# EAGLE design HDMI-Display_v10dev (EAGLE 6.6.0)

## Sheet 1 of 2
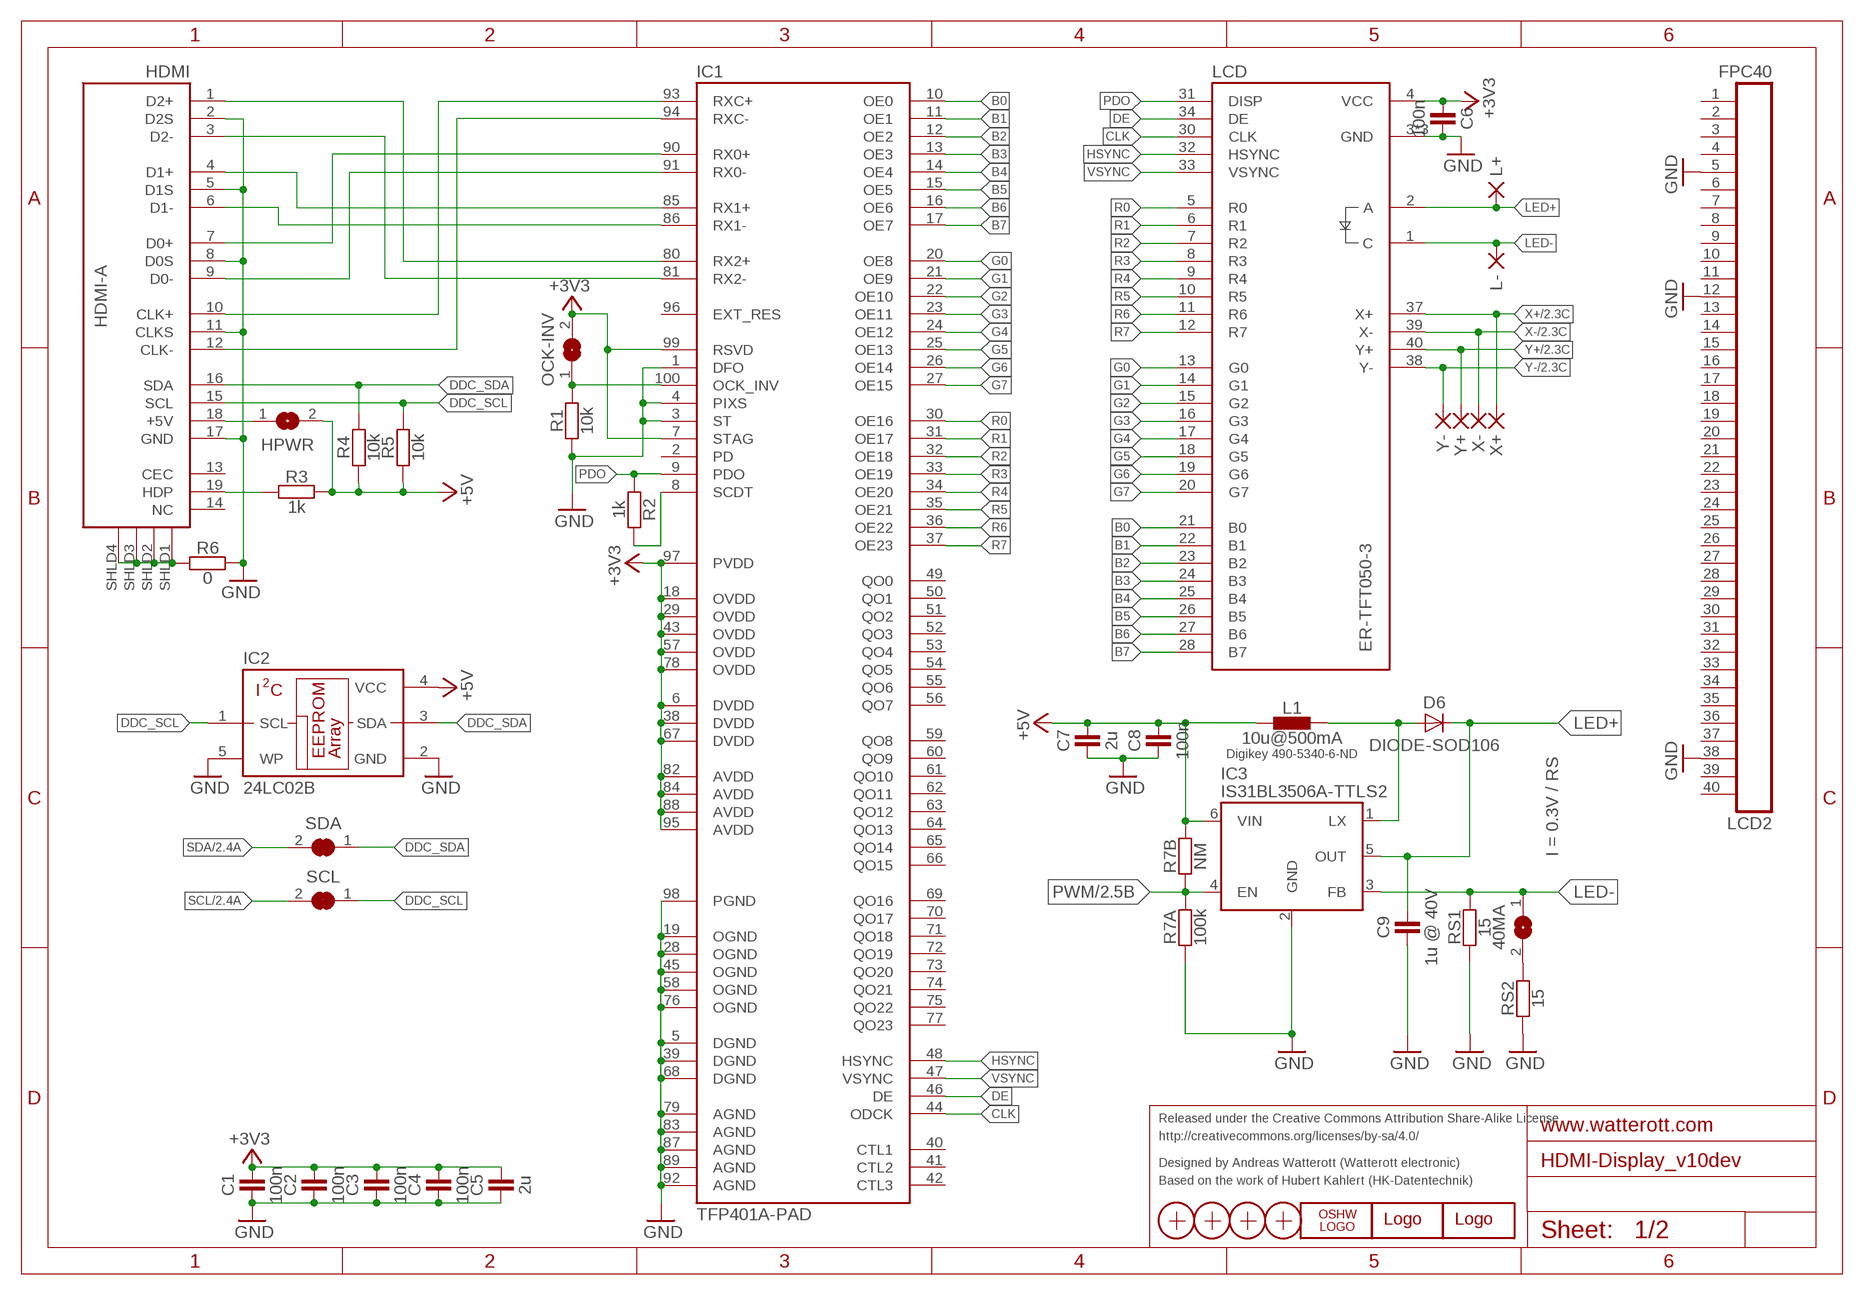
[diagram p0: schematic, sheet 1]

### Parts
40MA  JUMPER2  [JUMPER2]
C1  100n  CAPACITOR-C0402  [R0402]
C2  100n  CAPACITOR-C0402  [R0402]
C3  100n  CAPACITOR-C0402  [R0402]
C4  100n  CAPACITOR-C0402  [R0402]
C5  2u  CAPACITOR-C0402  [R0402]
C6  100n  CAPACITOR-C0402  [R0402]
C7  2u  CAPACITOR-C0402  [R0402]
C8  100n  CAPACITOR-C0402  [R0402]
C9  1u @ 40V  CAPACITOR-C0805  [R0805]
D6  DIODE-SOD106  [SOD106]
HDMI  HDMI-A  [HDMI_10029449]
HPWR  JUMPER2  [JUMPER2]
IC1  TFP401A-PAD  TFP101A-PAD  [TQFP100-PAD]
IC2  24LC02B  24LC-I/OT  [SOT23-5]
IC3  IS31BL3506A-TTLS2  [SOT23-6]
L1  10u@500mA  INDUCTOR-1212  [L_1212]
L+  PAD-0.80X1.60_NC  [PAD-0.80X1.60_NC]
L-  PAD-0.80X1.60_NC  [PAD-0.80X1.60_NC]
LCD  ER-TFT050-3  [FPC40]
LCD2  FPC40  [FPC40]
LOGO1  OSHW_LOGOX0070  [OSHW_6X70]
LOGO2  LOGO-PLACE  [LOGO_TPLACE]
LOGO3  LOGO-S_PLACE_S  [SPARK_TPLACE_S]
OCK-INV  JUMPER2  [JUMPER2]
R1  10k  RESISTOR-R0402  [R0402]
R2  1k  RESISTOR-R0402  [R0402]
R3  1k  RESISTOR-R0402  [R0402]
R4  10k  RESISTOR-R0402  [R0402]
R5  10k  RESISTOR-R0402  [R0402]
R6  0  RESISTOR-R0402  [R0402]
R7A  100k  RESISTOR-R0402  [R0402]
R7B  NM  RESISTOR-R0402  [R0402]
RS1  15  RESISTOR-R0402  [R0402]
RS2  15  RESISTOR-R0402  [R0402]
SCL  JUMPER2  [JUMPER2]
SDA  JUMPER2  [JUMPER2]
X1  PASSER-07  [PASSER_07MM]
X2  PASSER-07  [PASSER_07MM]
X3  PASSER-07  [PASSER_07MM]
X4  PASSER-07  [PASSER_07MM]
X+  PAD-0.80X1.60_NC  [PAD-0.80X1.60_NC]
X-  PAD-0.80X1.60_NC  [PAD-0.80X1.60_NC]
Y+  PAD-0.80X1.60_NC  [PAD-0.80X1.60_NC]
Y-  PAD-0.80X1.60_NC  [PAD-0.80X1.60_NC]

### Nets
+3V3: C1.2 C2.2 C3.2 C4.2 C5.2 C6.1 IC1.6(DVDD) IC1.7(STAG) IC1.18(OVDD) IC1.29(OVDD) IC1.38(DVDD) IC1.43(OVDD) IC1.57(OVDD) IC1.67(DVDD) IC1.78(OVDD) IC1.82(AVDD) IC1.84(AVDD) IC1.88(AVDD) IC1.95(AVDD) IC1.97(PVDD) IC1.99(RSVD) LCD.4(VCC) OCK-INV.2 ; also sheet 2
+5V: C7.2 C8.2 HPWR.2 IC2.4(VCC) IC3.6(VIN) L1.1 R3.2 R4.1 R5.1 R7B.2 ; also sheet 2
B0: IC1.10(OE0) LCD.21(B0)
B1: IC1.11(OE1) LCD.22(B1)
B2: IC1.12(OE2) LCD.23(B2)
B3: IC1.13(OE3) LCD.24(B3)
B4: IC1.14(OE4) LCD.25(B4)
B5: IC1.15(OE5) LCD.26(B5)
B6: IC1.16(OE6) LCD.27(B6)
B7: IC1.17(OE7) LCD.28(B7)
CLK: IC1.44(ODCK) LCD.30(CLK)
CLK_N: HDMI.12(CLK-) IC1.94(RXC-)
CLK_P: HDMI.10(CLK+) IC1.93(RXC+)
D0_N: HDMI.9(D0-) IC1.91(RX0-)
D0_P: HDMI.7(D0+) IC1.90(RX0+)
D1_N: HDMI.6(D1-) IC1.86(RX1-)
D1_P: HDMI.4(D1+) IC1.85(RX1+)
D2_N: HDMI.3(D2-) IC1.81(RX2-)
D2_P: HDMI.1(D2+) IC1.80(RX2+)
DDC_SCL: HDMI.15(SCL) IC2.1(SCL) R5.2 SCL.1
DDC_SDA: HDMI.16(SDA) IC2.3(SDA) R4.2 SDA.1
DE: IC1.46(DE) LCD.34(DE)
G0: IC1.20(OE8) LCD.13(G0)
G1: IC1.21(OE9) LCD.14(G1)
G2: IC1.22(OE10) LCD.15(G2)
G3: IC1.23(OE11) LCD.16(G3)
G4: IC1.24(OE12) LCD.17(G4)
G5: IC1.25(OE13) LCD.18(G5)
G6: IC1.26(OE14) LCD.19(G6)
G7: IC1.27(OE15) LCD.20(G7)
GND: C1.1 C2.1 C3.1 C4.1 C5.1 C6.2 C7.1 C8.1 C9.1 HDMI.2(D2S) HDMI.5(D1S) HDMI.8(D0S) HDMI.11(CLKS) HDMI.17(GND) IC1.1(DFO) IC1.3(ST) IC1.4(PIXS) IC1.5(DGND) IC1.19(OGND) IC1.28(OGND) IC1.39(DGND) IC1.45(OGND) IC1.58(OGND) IC1.68(DGND) IC1.76(OGND) IC1.79(AGND) IC1.83(AGND) IC1.87(AGND) IC1.89(AGND) IC1.92(AGND) IC1.98(PGND) IC2.2(GND) IC2.5(WP) IC3.2(GND) LCD2.5 LCD2.12 LCD2.38 LCD.3(GND) LCD.29(GND) LCD.36(GND) R1.1 R6.1 R7A.1 RS1.1 RS2.1 ; also sheet 2
HDMI_5V: HDMI.18(+5V) HPWR.1
HDMI_DECT: HDMI.19(HDP) R3.1
HSYNC: IC1.48(HSYNC) LCD.32(HSYNC)
LED+: C9.2 D6.C IC3.5(OUT) L+.1(P) LCD.2(A)
LED-: 40MA.1 IC3.3(FB) L-.1(P) LCD.1(C) RS1.2
LX: D6.A IC3.1(LX) L1.2
N$4: 40MA.2 RS2.2
N$6: IC1.100(OCK_INV) OCK-INV.1 R1.2
PDO: IC1.9(PDO) LCD.31(DISP) R2.1
PWM: IC3.4(EN) R7A.2 R7B.1 ; also sheet 2
R0: IC1.30(OE16) LCD.5(R0)
R1: IC1.31(OE17) LCD.6(R1)
R2: IC1.32(OE18) LCD.7(R2)
R3: IC1.33(OE19) LCD.8(R3)
R4: IC1.34(OE20) LCD.9(R4)
R5: IC1.35(OE21) LCD.10(R5)
R6: IC1.36(OE22) LCD.11(R6)
R7: IC1.37(OE23) LCD.12(R7)
SCDT: IC1.8(SCDT) R2.2
SCL: SCL.2 ; also sheet 2
SDA: SDA.2 ; also sheet 2
SHLD3: HDMI.SHLD1(SHLD) HDMI.SHLD2(SHLD) HDMI.SHLD3(SHLD) HDMI.SHLD4(SHLD) R6.2
VSYNC: IC1.47(VSYNC) LCD.33(VSYNC)
X+: LCD.37(X+) X+.1(P) ; also sheet 2
X-: LCD.39(X-) X-.1(P) ; also sheet 2
Y+: LCD.40(Y+) Y+.1(P) ; also sheet 2
Y-: LCD.38(Y-) Y-.1(P) ; also sheet 2
Unconnected: HDMI.13(CEC) HDMI.14(NC) IC1.2(PD) IC1.40(CTL1) IC1.41(CTL2) IC1.42(CTL3) IC1.49(QO0) IC1.50(QO1) IC1.51(QO2) IC1.52(QO3) IC1.53(QO4) IC1.54(QO5) IC1.55(QO6) IC1.56(QO7) IC1.59(QO8) IC1.60(QO9) IC1.61(QO10) IC1.62(QO11) IC1.63(QO12) IC1.64(QO13) IC1.65(QO14) IC1.66(QO15) IC1.69(QO16) IC1.70(QO17) IC1.71(QO18) IC1.72(QO19) IC1.73(QO20) IC1.74(QO21) IC1.75(QO22) IC1.77(QO23) IC1.96(EXT_RES) LCD2.1 LCD2.2 LCD2.3 LCD2.4 LCD2.6 LCD2.7 LCD2.8 LCD2.9 LCD2.10 LCD2.11 LCD2.13 LCD2.14 LCD2.15 LCD2.16 LCD2.17 LCD2.18 LCD2.19 LCD2.20 LCD2.21 LCD2.22 LCD2.23 LCD2.24 LCD2.25 LCD2.26 LCD2.27 LCD2.28 LCD2.29 LCD2.30 LCD2.31 LCD2.32 LCD2.33 LCD2.34 LCD2.35 LCD2.36 LCD2.37 LCD2.39 LCD2.40

### Notes on the sheet
- Digikey 490-5340-6-ND
- I = 0.3V / RS
- Released under the Creative Commons Attribution Share-Alike License
- http://creativecommons.org/licenses/by-sa/4.0/
- Designed by Andreas Watterott (Watterott electronic)
- Based on the work of Hubert Kahlert (HK-Datentechnik)

## Sheet 2 of 2
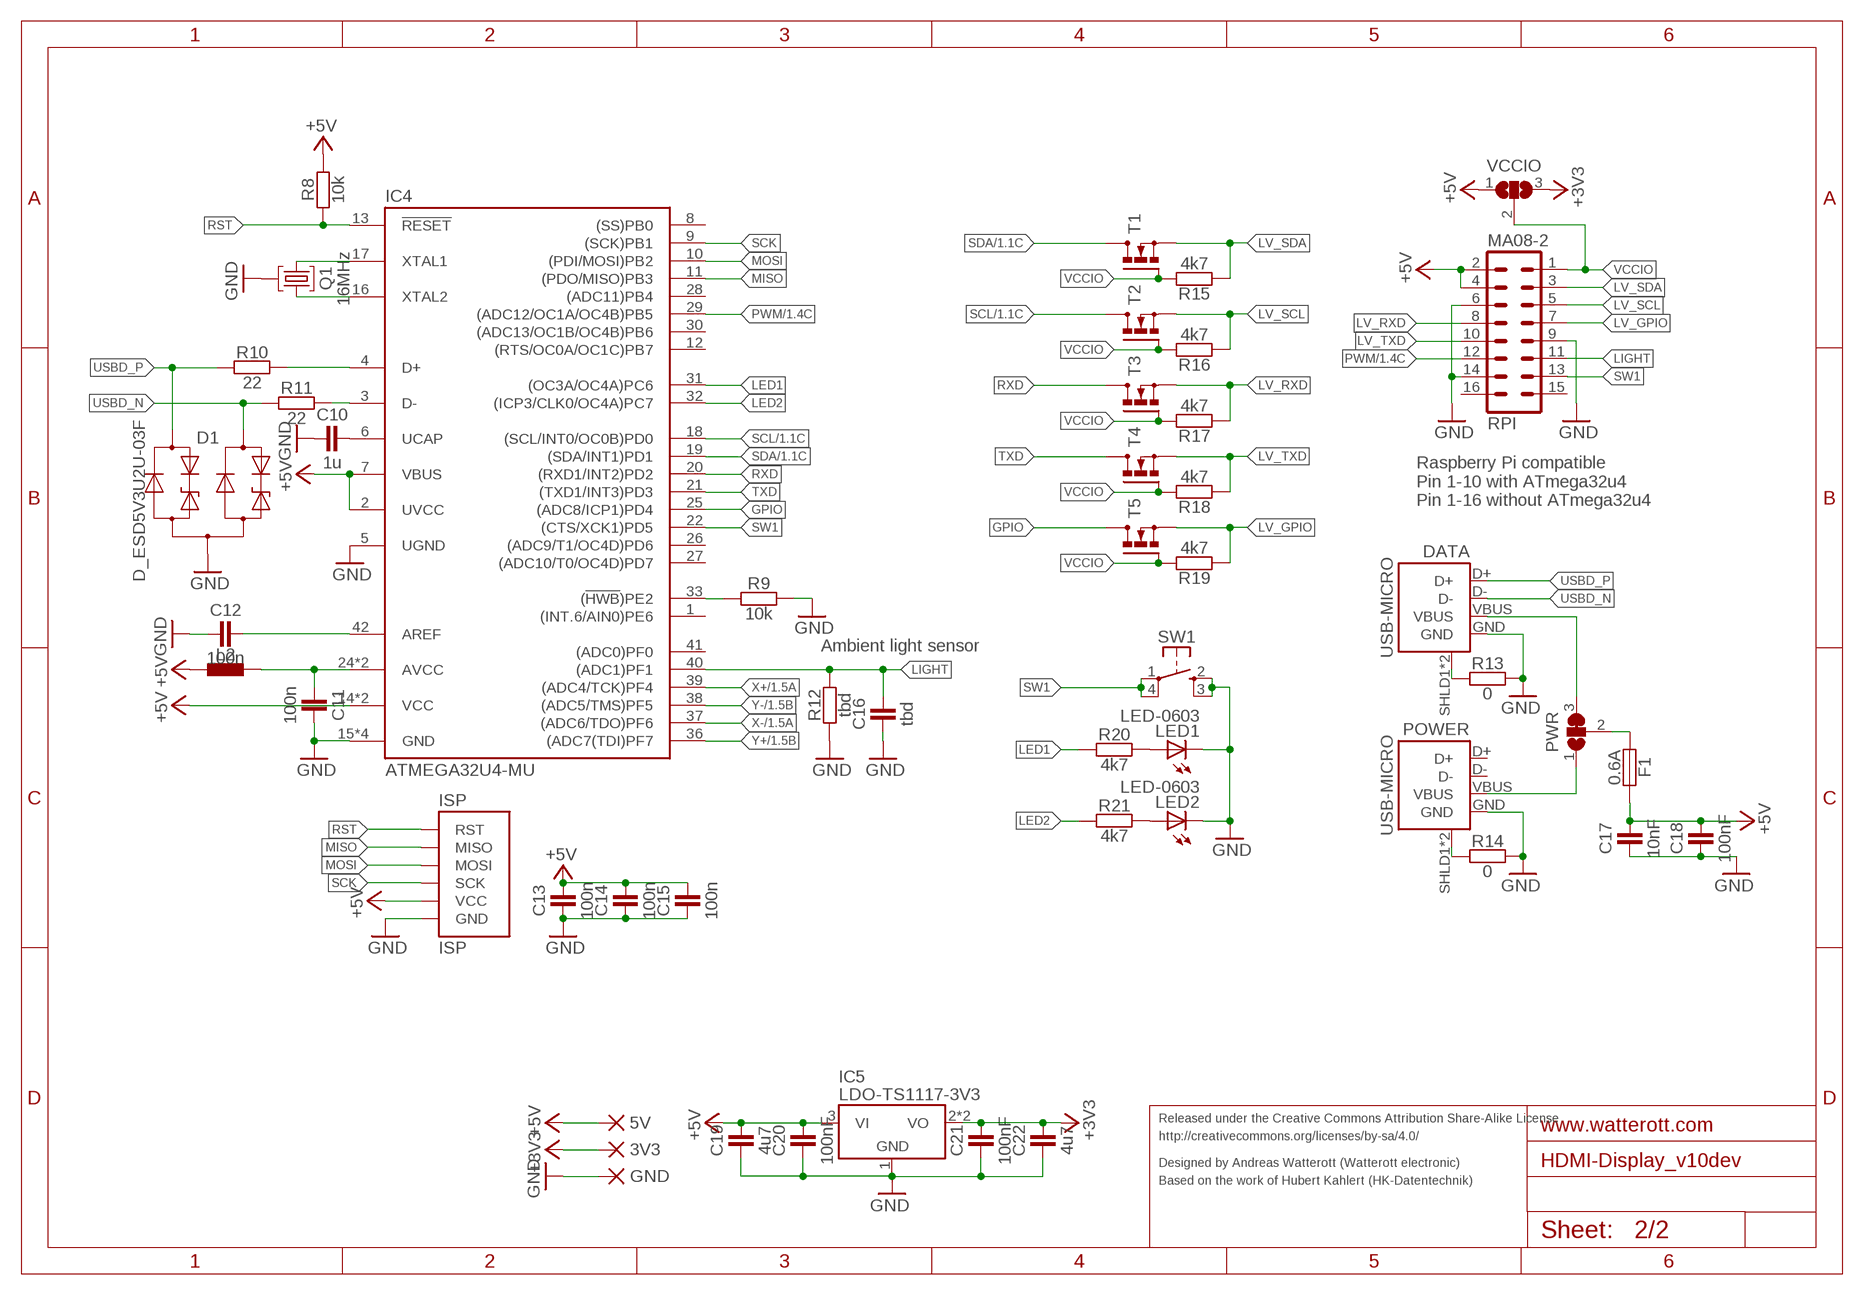
[diagram p1: schematic, sheet 2]

### Parts
3V3  PAD-1.27X2.54_NC  [PAD-1.27X2.54_NC]
5V  PAD-1.27X2.54_NC  [PAD-1.27X2.54_NC]
C10  1u  CAPACITOR-C0402  [R0402]
C11  100n  CAPACITOR-C0402  [R0402]
C12  100n  CAPACITOR-C0402  [R0402]
C13  100n  CAPACITOR-C0402  [R0402]
C14  100n  CAPACITOR-C0402  [R0402]
C15  100n  CAPACITOR-C0402  [R0402]
C16  tbd  CAPACITOR-C0402  [R0402]
C17  10nF  CAPACITOR-C0402  [R0402]
C18  100nF  CAPACITOR-C0402  [R0402]
C19  4u7  CAPACITOR-C0402  [R0402]
C20  100nF  CAPACITOR-C0402  [R0402]
C21  100nF  CAPACITOR-C0402  [R0402]
C22  4u7  CAPACITOR-C0402  [R0402]
D1  D_ESD5V3U2U-03F  [SOT723]
DATA  USB-MICRO  [USB-MICRO-10103594]
F1  0.6A  FUSE-0805  [R0805]
GND  PAD-1.27X2.54_NC  [PAD-1.27X2.54_NC]
IC4  ATMEGA32U4-MU  [QFN44]
IC5  LDO-TS1117-3V3  [SOT223]
ISP  ISP  [ISP]
L2  INDUCTOR-0603  [R0603]
LED1  LED-0603  [LED_0603]
LED2  LED-0603  [LED_0603]
POWER  USB-MICRO  [USB-MICRO-10103594]
PWR  JUMPER3  [JUMPER3]
Q1  16MHz  CRYSTAL-RES-32  [CRYSTAL_32X13]
R8  10k  RESISTOR-R0402  [R0402]
R9  10k  RESISTOR-R0402  [R0402]
R10  22  RESISTOR-R0402  [R0402]
R11  22  RESISTOR-R0402  [R0402]
R12  tbd  RESISTOR-R0402  [R0402]
R13  0  RESISTOR-R0402  [R0402]
R14  0  RESISTOR-R0402  [R0402]
R15  4k7  RESISTOR-R0402  [R0402]
R16  4k7  RESISTOR-R0402  [R0402]
R17  4k7  RESISTOR-R0402  [R0402]
R18  4k7  RESISTOR-R0402  [R0402]
R19  4k7  RESISTOR-R0402  [R0402]
R20  4k7  RESISTOR-R0402  [R0402]
R21  4k7  RESISTOR-R0402  [R0402]
RPI  MA08-2  [MA08-2]
SW1  SW-TACTILE-TL3315  [SW_TL3315N]
T1  MOSFET-N-SOT23  [SOT23]
T2  MOSFET-N-SOT23  [SOT23]
T3  MOSFET-N-SOT23  [SOT23]
T4  MOSFET-N-SOT23  [SOT23]
T5  MOSFET-N-SOT23  [SOT23]
VCCIO  JUMPER3-NOCREAM  [JUMPER3_NC]

### Nets
+3V3: 3V3.1(P) C21.2 C22.2 IC5.2(VO) IC5.4(VO) VCCIO.3 ; also sheet 1
+5V: 5V.1(P) C13.2 C14.2 C15.2 C17.2 C18.2 C19.2 C20.2 F1.1 IC4.2(UVCC) IC4.7(VBUS) IC4.14(VCC) IC4.34(VCC) IC5.3(VI) ISP.VCC L2.1 R8.2 RPI.2 RPI.4 VCCIO.1 ; also sheet 1
AREF: C12.2 IC4.42(AREF)
AVCC: C11.1 IC4.24(AVCC) IC4.44(AVCC) L2.2
D_N: IC4.3(D-) R11.2
D_P: IC4.4(D+) R10.2
GND: C10.1 C11.2 C12.1 C13.1 C14.1 C15.1 C16.1 C17.1 C18.1 C19.1 C20.1 C21.1 C22.1 D1.3(A) DATA.GND GND.1(P) IC4.5(UGND) IC4.15(GND) IC4.23(GND) IC4.35(GND) IC4.43(GND) IC5.1(GND) ISP.GND LED1.C LED2.C POWER.GND Q1.GND R9.2 R12.1 R13.1 R14.1 RPI.6 RPI.9 RPI.14 SW1.2(S1) SW1.3(S2) ; also sheet 1
GPIO: IC4.25((ADC8/ICP1)PD4) T5.3(D)
HWB: IC4.33((!HWB!)PE2) R9.1
LED1: IC4.31((OC3A/OC4A)PC6) R20.1
LED2: IC4.32((ICP3/CLK0/OC4A)PC7) R21.1
LIGHT: C16.2 IC4.40((ADC1)PF1) R12.2 RPI.11
LV_GPIO: R19.1 RPI.7 T5.2(S)
LV_RXD: R17.1 RPI.8 T3.2(S)
LV_SCL: R16.1 RPI.5 T2.2(S)
LV_SDA: R15.1 RPI.3 T1.2(S)
LV_TXD: R18.1 RPI.10 T4.2(S)
MISO: IC4.11((PDO/MISO)PB3) ISP.MISO
MOSI: IC4.10((PDI/MOSI)PB2) ISP.MOSI
N$8: C10.2 IC4.6(UCAP)
N$11: F1.2 PWR.2
N$17: LED1.A R20.2
N$18: LED2.A R21.2
PWM: IC4.29((ADC12/OC1A/OC4B)PB5) RPI.12 ; also sheet 1
RST: IC4.13(!RESET) ISP.RST R8.1
RXD: IC4.20((RXD1/INT2)PD2) T3.3(D)
SCK: IC4.9((SCK)PB1) ISP.SCK
SCL: IC4.18((SCL/INT0/OC0B)PD0) T2.3(D) ; also sheet 1
SDA: IC4.19((SDA/INT1)PD1) T1.3(D) ; also sheet 1
SHLD1: DATA.SHLD1(SHIELD) DATA.SHLD2(SHIELD) R13.2
SHLD2: POWER.SHLD1(SHIELD) POWER.SHLD2(SHIELD) R14.2
SW1: IC4.22((CTS/XCK1)PD5) RPI.13 SW1.1 SW1.4(P2)
TXD: IC4.21((TXD1/INT3)PD3) T4.3(D)
USBD_N: D1.2(C2) DATA.D- R11.1
USBD_P: D1.1(C1) DATA.D+ R10.1
VBUS: DATA.VBUS PWR.3
VBUS_PWR: POWER.VBUS PWR.1
VCCIO: R15.2 R16.2 R17.2 R18.2 R19.2 RPI.1 T1.1(G) T2.1(G) T3.1(G) T4.1(G) T5.1(G) VCCIO.2
X+: IC4.39((ADC4/TCK)PF4) ; also sheet 1
X-: IC4.37((ADC6/TDO)PF6) ; also sheet 1
XTAL1: IC4.17(XTAL1) Q1.2
XTAL2: IC4.16(XTAL2) Q1.1
Y+: IC4.36((ADC7(TDI)PF7) ; also sheet 1
Y-: IC4.38((ADC5/TMS)PF5) ; also sheet 1
Unconnected: IC4.1((INT.6/AIN0)PE6) IC4.8((SS)PB0) IC4.12((RTS/OC0A/OC1C)PB7) IC4.26((ADC9/T1/OC4D)PD6) IC4.27((ADC10/T0/OC4D)PD7) IC4.28((ADC11)PB4) IC4.30((ADC13/OC1B/OC4B)PB6) IC4.41((ADC0)PF0) POWER.D+ POWER.D- RPI.15 RPI.16

### Notes on the sheet
- Raspberry Pi compatible 
  Pin 1-10 with ATmega32u4
  Pin 1-16 without ATmega32u4
- Ambient light sensor
- Released under the Creative Commons Attribution Share-Alike License
- http://creativecommons.org/licenses/by-sa/4.0/
- Designed by Andreas Watterott (Watterott electronic)
- Based on the work of Hubert Kahlert (HK-Datentechnik)

## Library data of the parts
3V3 5V GND L+ L- X+ X- Y+ Y- = we-rcl:PAD: Pads
40MA HPWR OCK-INV SCL SDA = we-rcl:JUMPER2: 2 Pin Jumpers
C1-C22 = we-rcl:CAPACITOR: Capacitors ...4.7uF @ 6.3V -> 0402 ...10uF @ 16V -> 0603 ...22uF @ 25V -> 0805
D1 = we-rcl:D_ESD5V3U2U: TVS Diode - Uni-directional Ultra Low ESD / Transient Protection Diode (0.4pF@1MHz, 5V); DIGIKEY: ESD5V3U2U-03F H6327DKR-ND
D6 = we-rcl:DIODE: Diodes
DATA POWER = we-con:USB: USB Connectors; DIGIKEY: 609-4050-6-ND
F1 = we-rcl:FUSE: Fuses
HDMI = we-con:HDMI: HDMI Connectors; DIGIKEY: 609-4614-2-ND
IC1 = we-chip:TFP101A: TI TFP401A HDMI/DVI Receiver; DIGIKEY: 296-9987-ND
IC2 = we-chip:24LC*: Microchip I2C EEPROM 2 Kbit - 24LC02B - 24LC02BT-I/OTDKR-ND 32 Kbit- 24LC32A - 24LC32AT-I/OTDKR-ND; DIGIKEY: 24LC32AT-I/OTDKR-ND
IC3 = we-power:IS31BL3506A: ISSI IS31BL3506A Boost Converter for LED Backlight Input: 2.7...5V Output: up to 35V 300mV Feedback Voltage; DIGIKEY: 706-1213-6-ND
IC4 = we-chip:ATMEGA32U4: Atmel ATmega16U4/32U4 AVR Microcontroller
IC5 = we-power:LDO: LDOs TS1117 800mA, Vin max 12V TS9011 250mA, Vin max 12V - compatible AP2210 300mA, Vin max 15V TS5204 150mA, Vin max 16V
ISP = we-board:ISP: 2x6pol ISP connector
L1 = we-power:INDUCTOR: Power Inductors
L2 = we-rcl:INDUCTOR: Inductors
LCD = we-opto:ER-TFT: EastRising Displays ER-TFT043-3 - 4.3" 480x272 (LED 15mA @ 25.0V) ER-TFT050-3 - 5.0" 800x480 (LED @ 40mA @ 19.2V) ER-TFT070-4 - 7.0" 800x480 (LED @ 40mA @ 20.4V)
LCD2 = we-con:FPC40: FPC/ZIF Connector
LED1 LED2 = we-opto:LED: LEDs
LOGO1 = we-symbol:OSHW_LOGO: Open-Source-Hardware Logo
LOGO2 LOGO3 = we-symbol:LOGO: Watterott electronic Logo
PWR VCCIO = we-rcl:JUMPER3: 3 Pin Jumpers
Q1 = we-rcl:CRYSTAL-RES: Crystals Resonator
R1-R6 R7A R7B R8-R21 RS1 RS2 = we-rcl:RESISTOR: Resistors all kinds in 0603 and 0402
RPI = we-con:MA08-2: PIN HEADER; OC_FARNELL: unknown; OC_NEWARK: unknown
SW1 = we-switch:SW-TACTILE: Tactile Switches; DIGIKEY: EG4621TR-ND
T1-T5 = we-transistor:MOSFET-N: N-Channel MOSFET (e.g. IRLML2502, BSS138)
X1-X4 = we-symbol:PASSER: Fiducial Markers

## Board
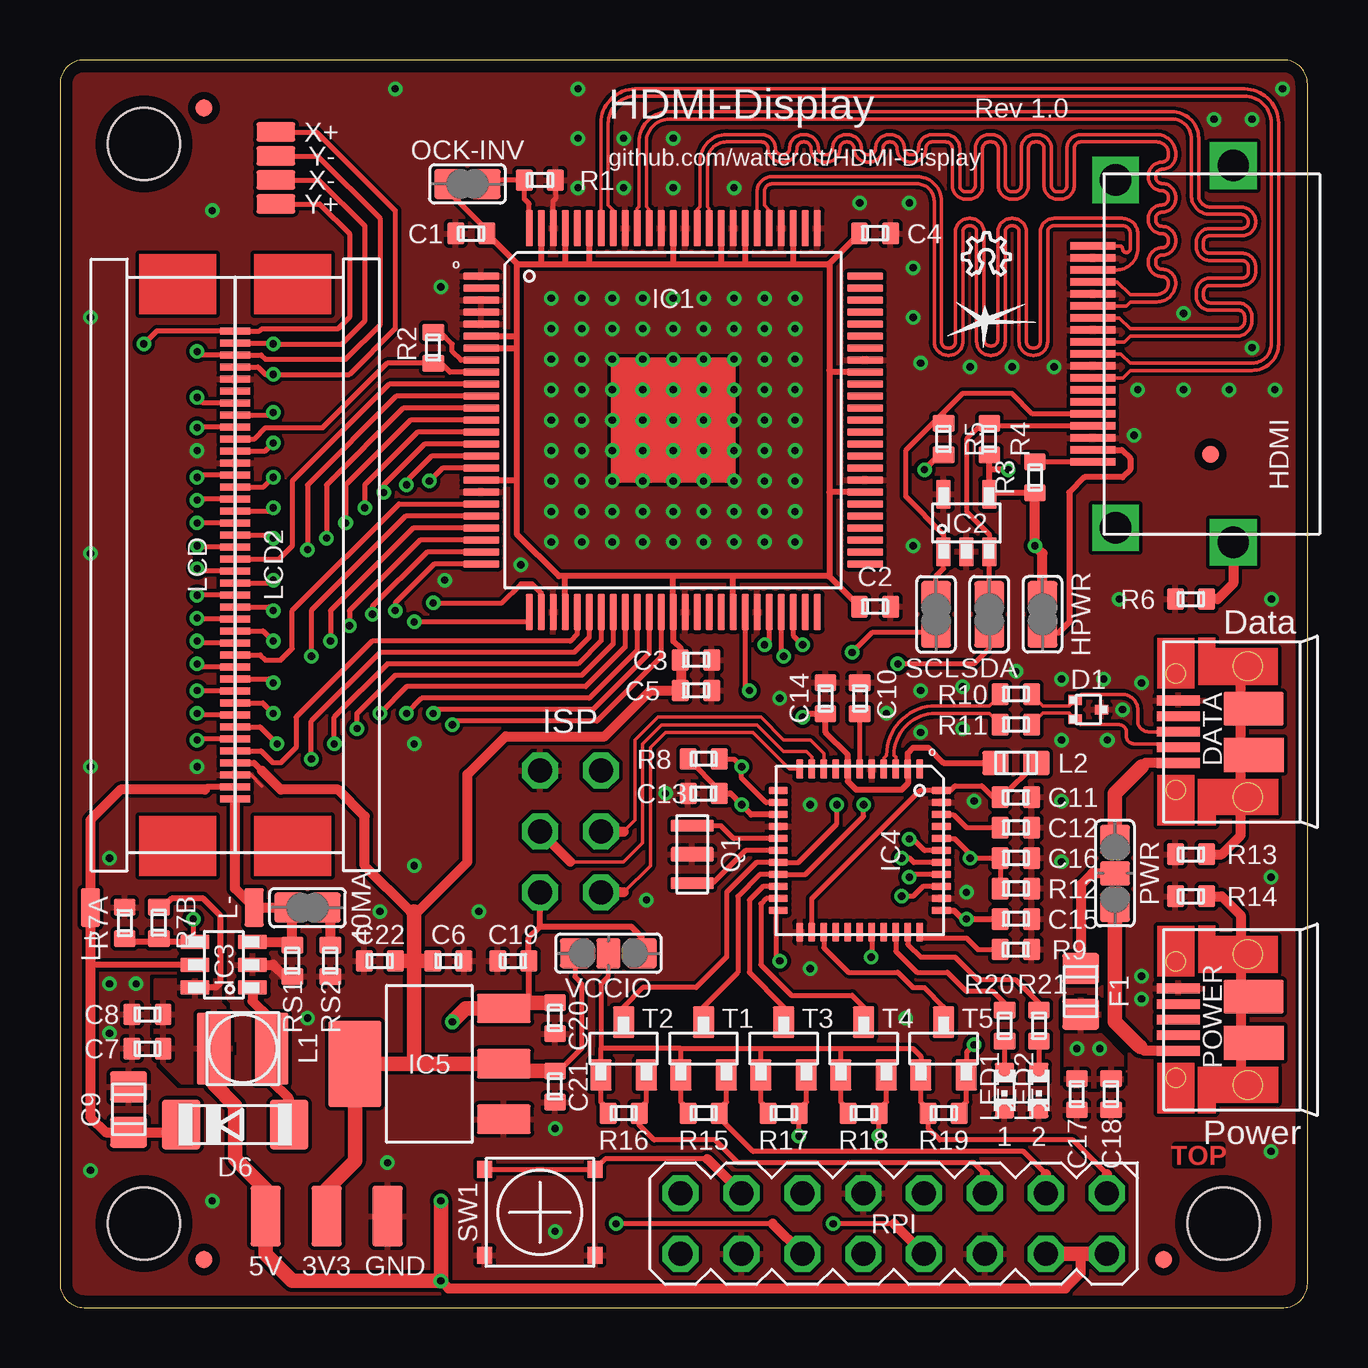
[diagram p2: board, top side]
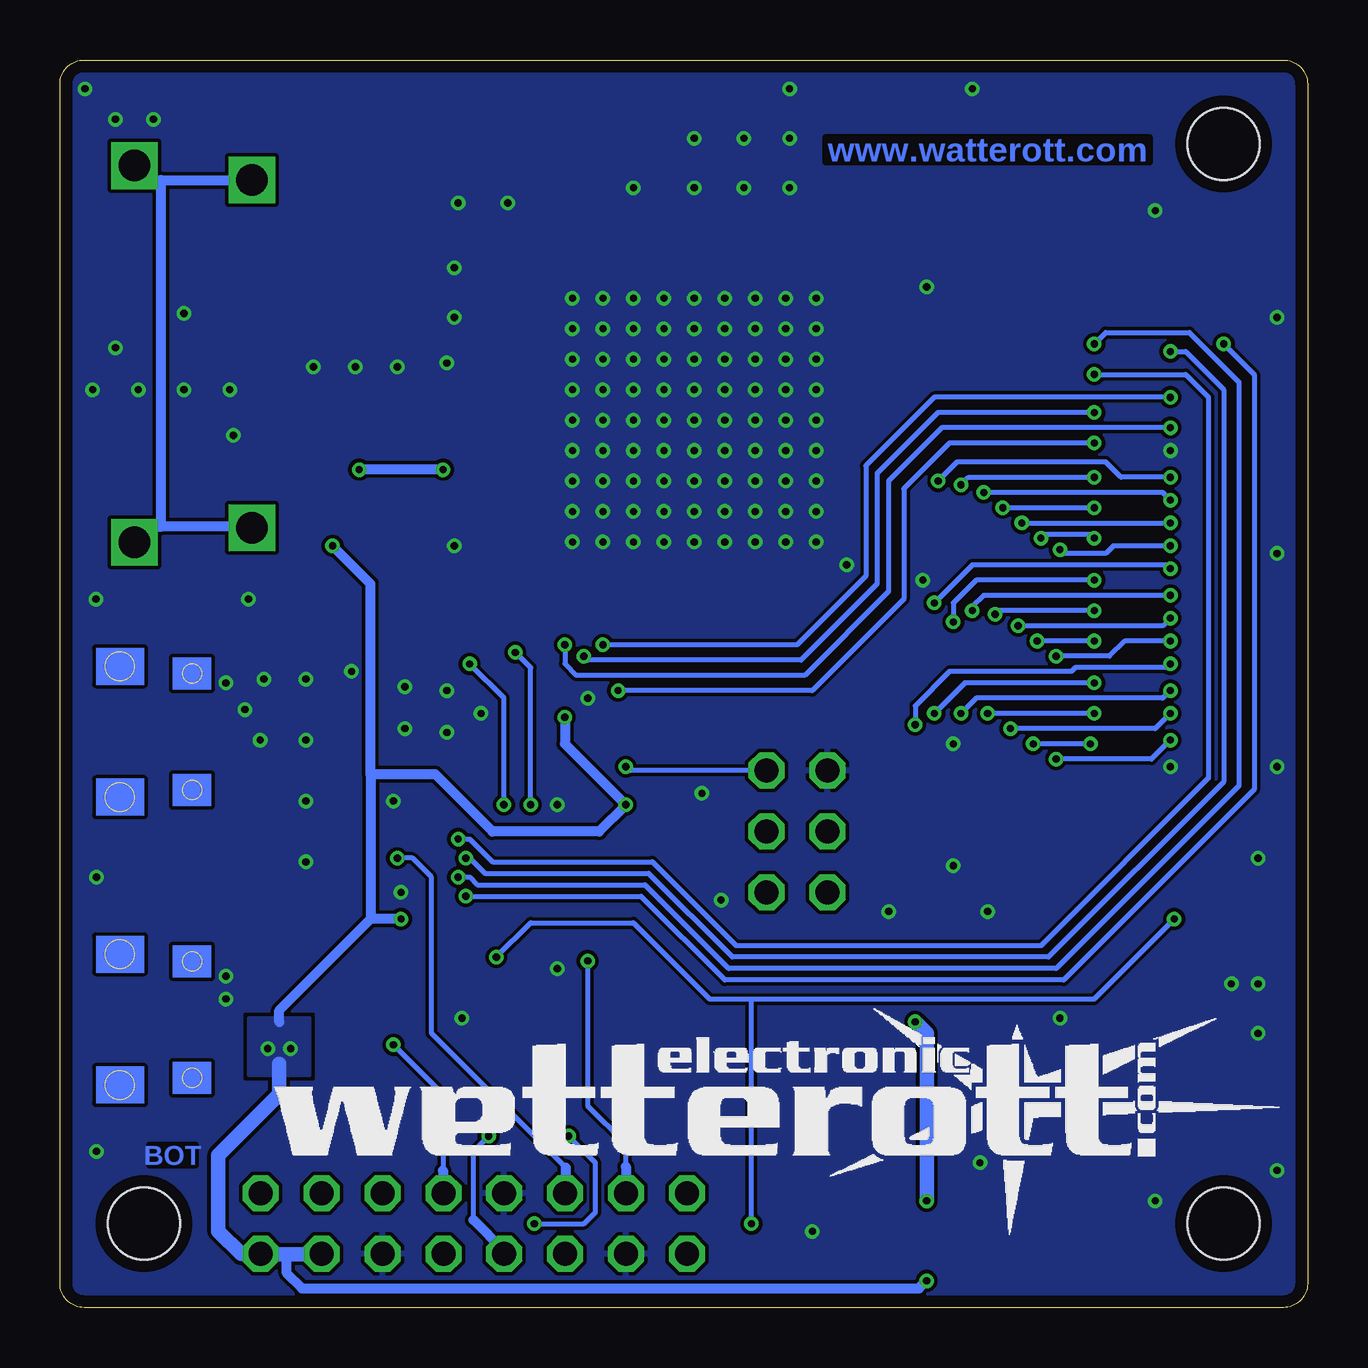
[diagram p3: board, bottom side, seen from below]

Size 52 x 52 mm. Coordinates in mm from the lower left corner, seen from the top.
Outline: 1,0 51,0 arc90 52,1 52,51 arc90 51,52 1,52 arc90 0,51 0,1 arc90 1,0
Copper layers (1*16): Top 0.035mm / dielectric 1.5mm / Bottom 0.035mm
Design rules "default *": minimum track width 6mil, minimum drill 0.3mm, track to track 6mil, track to pad 6mil, pad to pad 6mil, via to via 6mil, smd to smd 6mil, copper to edge 20mil, drill to drill 6mil, minimum pad ring 8mil, minimum via ring 6mil, stop-mask expansion 4mil, vias tented up to drill 0.5mm, thermal gap 6mil
Holes 3 mm at 48.5,3.5 3.5,3.5 3.5,48.5

### Footprints (pad centres in the part's own frame; a part is rotated, then mirrored left to right if it is on the bottom)
PAD-1.27X2.54_NC = smd 1.27 x 2.54: 1 0,0
JUMPER2 = smd 1.25 x 1.25: 1 0,0.76; 2 0,-0.76
R0402 = smd 0.9 x 0.7: 1 0,0.65; 2 0,-0.65
R0805 = smd 1.55 x 1.3: 1 0,0.95; 2 0,-0.95
SOT723 = smd 0.6 x 0.4: 1 -0.55,0.4; 2 -0.55,-0.4; 3 0.55,0
SOD106 = smd 2.1 x 1.6: A 0,-2.25; C 0,2.25
USB-MICRO-10103594 = smd 1.85 x 0.4: D+ -2.885,0; D- -2.885,-0.65; GND -2.885,1.3; ID -2.885,0.65; VBUS -2.885,-1.3 | smd 2.5 x 1.425: SHLD1 0.25,-0.963; SHLD2 0.25,0.963
HDMI_10029449 = smd 1.9 x 0.3: 1 -0.95,4.5; 2 -0.95,4; 3 -0.95,3.5; 4 -0.95,3; 5 -0.95,2.5; 6 -0.95,2; 7 -0.95,1.5; 8 -0.95,1; 9 -0.95,0.5; 10 -0.95,0; 11 -0.95,-0.5; 12 -0.95,-1; 13 -0.95,-1.5; 14 -0.95,-2; 15 -0.95,-2.5; 16 -0.95,-3; 17 -0.95,-3.5; 18 -0.95,-4; 19 -0.95,-4.5 | drill 1.3 square: SHLD1 0,-7.25; SHLD2 4.9,-7.85; SHLD3 4.9,7.85; SHLD4 0,7.25
TQFP100-PAD = smd 1.5 x 0.3: 1 -8,6; 2 -8,5.5; 3 -8,5; 4 -8,4.5; 5 -8,4; 6 -8,3.5; 7 -8,3; 8 -8,2.5; 9 -8,2; 10 -8,1.5; 11 -8,1; 12 -8,0.5; 13 -8,0; 14 -8,-0.5; 15 -8,-1; 16 -8,-1.5; 17 -8,-2; 18 -8,-2.5; 19 -8,-3; 20 -8,-3.5; 21 -8,-4; 22 -8,-4.5; 23 -8,-5; 24 -8,-5.5; 25 -8,-6; 51 8,-6; 52 8,-5.5; 53 8,-5; 54 8,-4.5; 55 8,-4; 56 8,-3.5; 57 8,-3; 58 8,-2.5; 59 8,-2; 60 8,-1.5; 61 8,-1; 62 8,-0.5; 63 8,0; 64 8,0.5; 65 8,1; 66 8,1.5; 67 8,2; 68 8,2.5; 69 8,3; 70 8,3.5; 71 8,4; 72 8,4.5; 73 8,5; 74 8,5.5; 75 8,6 | smd 0.3 x 1.5: 26 -6,-8; 27 -5.5,-8; 28 -5,-8; 29 -4.5,-8; 30 -4,-8; 31 -3.5,-8; 32 -3,-8; 33 -2.5,-8; 34 -2,-8; 35 -1.5,-8; 36 -1,-8; 37 -0.5,-8; 38 0,-8; 39 0.5,-8; 40 1,-8; 41 1.5,-8; 42 2,-8; 43 2.5,-8; 44 3,-8; 45 3.5,-8; 46 4,-8; 47 4.5,-8; 48 5,-8; 49 5.5,-8; 50 6,-8; 76 6,8; 77 5.5,8; 78 5,8; 79 4.5,8; 80 4,8; 81 3.5,8; 82 3,8; 83 2.5,8; 84 2,8; 85 1.5,8; 86 1,8; 87 0.5,8; 88 0,8; 89 -0.5,8; 90 -1,8; 91 -1.5,8; 92 -2,8; 93 -2.5,8; 94 -3,8; 95 -3.5,8; 96 -4,8; 97 -4.5,8; 98 -5,8; 99 -5.5,8; 100 -6,8
SOT23-5 = smd 1.2 x 0.6: 1 -1.2,0.95; 2 -1.2,0; 3 -1.2,-0.95; 4 1.2,-0.95; 5 1.2,0.95
SOT23-6 = smd 1.2 x 0.6: 1 -1.2,0.95; 2 -1.2,0; 3 -1.2,-0.95; 4 1.2,-0.95; 5 1.2,0; 6 1.2,0.95
QFN44 = smd 0.8 x 0.3: 1 -3.4,2.5; 2 -3.4,2; 3 -3.4,1.5; 4 -3.4,1; 5 -3.4,0.5; 6 -3.4,0; 7 -3.4,-0.5; 8 -3.4,-1; 9 -3.4,-1.5; 10 -3.4,-2; 11 -3.4,-2.5; 23 3.4,-2.5; 24 3.4,-2; 25 3.4,-1.5; 26 3.4,-1; 27 3.4,-0.5; 28 3.4,0; 29 3.4,0.5; 30 3.4,1; 31 3.4,1.5; 32 3.4,2; 33 3.4,2.5 | smd 0.3 x 0.8: 12 -2.5,-3.4; 13 -2,-3.4; 14 -1.5,-3.4; 15 -1,-3.4; 16 -0.5,-3.4; 17 0,-3.4; 18 0.5,-3.4; 19 1,-3.4; 20 1.5,-3.4; 21 2,-3.4; 22 2.5,-3.4; 34 2.5,3.4; 35 2,3.4; 36 1.5,3.4; 37 1,3.4; 38 0.5,3.4; 39 0,3.4; 40 -0.5,3.4; 41 -1,3.4; 42 -1.5,3.4; 43 -2,3.4; 44 -2.5,3.4
SOT223 = smd 2.235 x 1.219: 1 -3.099,2.311; 2 -3.099,0; 3 -3.099,-2.311 | smd 2.2 x 3.6: 4 3.099,0
ISP = drill 1 octagon: GND 1.27,-2.54; MISO -1.27,2.54; MOSI 1.27,0; RST -1.27,-2.54; SCK -1.27,0; VCC 1.27,2.54
L_1212 = smd 3 x 1.4: 1 0,1.2; 2 0,-1.2
R0603 = smd 1 x 1.1: 1 0,0.85; 2 0,-0.85
PAD-0.80X1.60_NC = smd 0.8 x 1.6: 1 0,0
FPC40 = smd 1.27 x 0.279: 1 0.003,9.75; 2 0.003,9.25; 3 0.003,8.75; 4 0.003,8.25; 5 0.003,7.75; 6 0.003,7.25; 7 0.003,6.75; 8 0.003,6.25; 9 0.003,5.75; 10 0.003,5.25; 11 0.003,4.75; 12 0.003,4.25; 13 0.003,3.75; 14 0.003,3.25; 15 0.003,2.75; 16 0.003,2.25; 17 0.003,1.75; 18 0.003,1.25; 19 0.003,0.75; 20 0.003,0.25; 21 0.003,-0.25; 22 0.003,-0.75; 23 0.003,-1.25; 24 0.003,-1.75; 25 0.003,-2.25; 26 0.003,-2.75; 27 0.003,-3.25; 28 0.003,-3.75; 29 0.003,-4.25; 30 0.003,-4.75; 31 0.003,-5.25; 32 0.003,-5.75; 33 0.003,-6.25; 34 0.003,-6.75; 35 0.003,-7.25; 36 0.003,-7.75; 37 0.003,-8.25; 38 0.003,-8.75; 39 0.003,-9.25; 40 0.003,-9.75
LED_0603 = smd 0.8 x 0.8: A 0,-0.75; C 0,0.75
JUMPER3 = smd 1.25 x 1.25: 1 0,1.4; 3 0,-1.4 | smd 1.25 x 1: 2 0,0
CRYSTAL_32X13 = smd 1.8 x 0.5: 1 0,1.2; 2 0,-1.2 | smd 1.8 x 0.6: GND 0,0
MA08-2 = drill 1 octagon: 1 -1.27,8.89; 2 1.27,8.89; 3 -1.27,6.35; 4 1.27,6.35; 5 -1.27,3.81; 6 1.27,3.81; 7 -1.27,1.27; 8 1.27,1.27; 9 -1.27,-1.27; 10 1.27,-1.27; 11 -1.27,-3.81; 12 1.27,-3.81; 13 -1.27,-6.35; 14 1.27,-6.35; 15 -1.27,-8.89; 16 1.27,-8.89
SW_TL3315N = smd 0.65 x 0.7: 1 -2.3,1.8; 2 -2.3,-1.8; 3 2.3,-1.8; 4 2.3,1.8
SOT23 = smd 1.3 x 0.9: 1 -1.1,0.95; 2 -1.1,-0.95; 3 1.1,0
JUMPER3_NC = smd 1.25 x 1.25: 1 0,1.4; 3 0,-1.4 | smd 1.25 x 1: 2 0,0
PASSER_07MM = smd 0.7 x 0.7: X 0,0

### Placement (x,y rotation side)
3V3  11.11,3.81 180 top
5V  8.57,3.81 180 top
40MA  10.32,16.67 90 top
C1  17.14,44.77 90 top
C2  33.97,29.21 270 top
C3  26.51,26.99 270 top
C4  33.97,44.77 270 top
C5  26.51,25.72 270 top
C6  16.19,14.45 90 top
C7  3.65,10.79 90 top
C8  3.65,12.22 90 top
C9  2.86,8.26 0 top
C10  33.34,25.4 0 top
C11  39.85,21.27 90 top
C12  39.85,20 270 top
C13  26.83,21.43 90 top
C14  31.91,25.4 0 top
C15  39.85,16.19 270 top
C16  39.85,18.73 270 top
C17  42.39,8.89 180 top
C18  43.81,8.89 180 top
C19  18.89,14.45 90 top
C20  20.64,12.06 180 top
C21  20.64,9.21 180 top
C22  13.34,14.45 90 top
D1  42.86,24.92 0 top
D6  7.3,7.62 90 top
DATA  49.5,24 0 top
F1  42.55,13.18 180 top
GND  13.65,3.81 180 top
HDMI  44,39.75 0 top
HPWR  40.96,28.89 180 top
IC1  25.56,36.99 0 top
IC2  37.78,32.7 90 top
IC3  6.83,14.29 180 top
IC4  33.34,19.05 270 top
IC5  15.4,10.16 180 top
ISP  21.27,19.84 180 top
L1  7.62,10.79 90 top
L2  39.85,22.7 90 top
L+  1.27,16.67 0 top
L-  8.1,16.67 0 top
LCD  7.3,30.96 180 top
LCD2  7.3,30.96 0 top
LED1  39.37,9.05 180 top
LED2  40.8,9.05 180 top
LOGO1  37.62,43.02 0 top
LOGO2  43.34,2.7 0 bottom
LOGO3  38.58,41.12 0 top
OCK-INV  16.99,46.83 270 top
POWER  49.5,12 0 top
PWR  43.97,18.1 180 top
Q1  26.35,18.89 0 top
R1  20,46.99 270 top
R2  15.56,40.01 180 top
R3  40.64,34.61 0 top
R4  38.73,36.2 180 top
R5  36.83,36.2 180 top
R6  47.15,29.53 90 top
R7A  2.7,16.03 0 top
R7B  100k  [R0402]  4.13,16.03 180 top
R8  26.83,22.86 270 top
R9  39.85,14.92 90 top
R10  39.85,25.56 270 top
R11  39.85,24.29 270 top
R12  39.85,17.46 270 top
R13  47.15,18.89 90 top
R14  47.15,17.14 90 top
R15  26.83,8.1 270 top
R16  23.5,8.1 270 top
R17  30.16,8.1 270 top
R18  33.5,8.1 270 top
R19  36.83,8.1 270 top
R20  39.37,11.75 0 top
R21  40.8,11.75 0 top
RPI  34.75,3.5 270 top
RS1  9.68,14.45 180 top
RS2  11.27,14.45 180 top
SCL  36.51,28.89 0 top
SDA  38.73,28.89 0 top
SW1  20,3.97 0 top
T1  26.83,10.79 90 top
T2  23.5,10.79 90 top
T3  30.16,10.79 90 top
T4  33.5,10.79 90 top
T5  36.83,10.79 90 top
VCCIO  22.86,14.76 270 top
X1  6,2 90 top
X2  6,50 90 top
X3  47.96,35.56 90 top
X4  46,2 90 top
X+  9,49 90 top
X-  9,47 90 top
Y+  9,46 90 top
Y-  9,48 90 top

### Tracks (layer width: path | path; a pad name or v marks a point on that pad's centre or on a via)
+3V3
  Top 0.203: 20.06,43.55 20,43.5 | 22.06,43.51 22.07,43.5 | 30.56,43.58 30.48,43.5 | 28.56,43.51 28.57,43.5 | 27.56,43.56 27.62,43.5 | 32.13,38.99 32.07,39.05 | 32.08,33.99 32.07,33.97 | 28.06,30.44 28.1,30.48 | 21.06,30.43 21.11,30.48 | 19.04,40.49 19.05,40.48 | 19.03,39.99 19.05,40.01 | 19.01,34.49 19.05,34.45 | 21.06,43.55 21.11,43.5 | OCK-INV.2 16.23,46.48 17.78,44.93 17.78,44.78 C1.2 | VCCIO.3 21.46,13.78 21.75,13.49 21.75,10.79 20.81,9.86 C21.2 | 25.88,27.46 25.88,26.99 C3.2
  Top 0.254: 19.05,43.5 19.05,40.48 19.05,40.01 19.05,34.45 19.05,32.23 20.8,30.48 21.11,30.48 25.56,30.48 | 19.05,43.5 20,43.5 21.11,43.5 22.07,43.5 25.56,43.5 | 25.56,43.5 27.62,43.5 28.57,43.5 30.48,43.5 32.07,43.5 | 32.07,43.5 32.07,39.05 32.07,33.97 32.07,30.48 | 32.07,30.48 28.1,30.48 25.56,30.48 | IC1.99 20.06,43.55 | IC1.95 22.06,43.51 | IC1.78 30.56,43.58 | IC1.82 28.56,43.51 | IC1.84 27.56,43.56 | IC1.88 25.56,43.5 | IC1.67 32.13,38.99 | IC1.57 32.08,33.99 | IC1.43 28.06,30.44 | 25.56,30.48 IC1.38 25.56,27.78 25.88,27.46 | IC1.29 21.06,30.43 | IC1.6 19.04,40.49 | IC1.7 19.03,39.99 | IC1.18 19.01,34.49 | IC1.97 21.06,43.55 | LCD.4 8.09,22.71 8.41,22.38 | 32.07,43.5 32.07,43.51 C4.2 | 19.05,43.5 19.05,43.51 C1.2 | 32.07,30.48 32.07,30.46 C2.2 | 25.88,25.73 C5.2
  Top 0.406: 8.41,22.38 9.21,21.59 11.59,21.59 12.7,20.48 12.7,18.41 14.61,16.51 14.76,16.51 14.92,16.51 16.99,18.57 16.99,22.23 18.57,23.81 22.7,23.81 24.61,25.72 C5.2 | 25.88,26.99 25.88,25.73
  Top 0.61: 14.92,10.16 IC5.2 18.8,9.86 C21.2 | 14.92,10.16 IC5.4 12.3,6.11 11.11,4.92 3V3.1 | 14.92,10.16 14.76,10.32 14.76,14.45 | C22.2 14.76,14.45 | C6.1 14.76,14.45 | 14.76,14.45 14.76,16.51
+5V  (via drill 0.3)
  Top 0.203: IC5.3 | 19.54,12.84 19.68,12.7 | R8.2 26.19,22.86 27.48,21.57 C13.2 | 20.58,12.7 20.62,12.7 C20.2 | 38.79,33.96 IC2.4 | R4.1 38.75,35.55 | R5.1 36.66,35.55
  Top 0.254: IC3.6 6.51,13.34 6.67,13.49 6.67,16.35 5.98,17.04 4.66,17.04 4.29,16.67 4.14,16.67 R7B.2 | IC4.34 37.27,16.55 37.62,16.19 v37.78,16.19 C15.2 | L2.1 36.83,22.7 36.2,23.34 35.56,23.34 35.34,23.11 IC4.2 35.34,21.84 35.08,21.59 33.18,21.59 32.84,21.93 IC4.7 32.84,23.04 31.91,23.97 C14.2 | 31.91,24.61 C14.2 | VCCIO.1 24.26,15.43 23.81,15.88 20,15.88 | 20,15.88 ISP.VCC | 20,15.88 19.54,15.41 C19.2 19.54,12.84 | IC4.14 28.82,20.55 v28.42,20.95 27.94,21.43 C13.2 | v30.96,24.61 31.11,24.77 31.91,24.77 C14.2 | R3.2 38.79,33.96 | IC2.4 38.73,34.92 | 38.73,34.92 R4.1 | v39.53,34.92 38.73,34.92 | 36.66,35.55 v36.04,34.92
  Top 0.406: v15.88,1.11 16.19,0.79 41.91,0.79 42.54,1.42 42.54,2.22 | HPWR.2 40.96,31.43 v40.64,31.75 R3.2
  Top 0.61: IC5.3 18.73,12.7 19.68,12.7 20.58,12.7 | L1.1 6.42,9.3 7.3,8.41 7.3,6.19 8.57,4.92 5V.1 8.57,2.22 9.68,1.11 v15.88,1.11 v15.88,4.45 | IC5.3 16.92,12.47 v16.35,11.91 | RPI.2 42.55,2.23 | 42.55,2.23 RPI.4 | 42.54,2.22 42.55,2.23
  Bottom 0.406: 39.05,22.23 36.35,22.23 33.97,19.84 29.53,19.84 v28.42,20.95 30.96,23.5 v30.96,24.61 | 39.05,22.23 39.05,16.19 | v37.78,16.19 39.05,16.19 | 42.86,11.91 42.86,12.38 39.05,16.19 | v36.04,34.92 v39.53,34.92 | v15.88,1.11 16.19,0.79 41.91,0.79 42.55,1.43 42.55,2.22 | RPI.4 41.12,2.22 | 39.05,22.23 39.05,30.16 v40.64,31.75
  Bottom 0.61: 42.86,10.16 42.86,8.89 45.4,6.35 45.4,3.17 44.46,2.23 RPI.2 | v15.88,4.45 15.88,11.43 v16.35,11.91 | 41.12,2.22 42.55,2.22 43.66,2.22
  other vias: 43.34,10.79 42.39,10.79
  pour Top: 3.97,13.65 3.97,10.48 5.08,9.37 7.14,9.37 7.14,12.22 6.67,12.7 6.67,13.65
  pour Top: 41.91,12.86 41.91,9.21 44.29,9.21 44.29,10.48 43.34,11.43 43.34,12.86
  pour Bottom: 41.59,9.68 44.13,9.68 44.13,12.06 41.59,12.06
AREF
  Top 0.203: IC4.42 37.23,20.55 37.78,20 C12.2
AVCC
  Top 0.203: IC4.24 31.34,17.05 35.84,21.55 IC4.44 37.11,21.55 37.31,21.75 38.42,21.75 38.89,21.27 C11.1 39.27,21.27 L2.2
B0
  Top 0.203: IC1.10 13.72,38.49 9.68,34.45 9.68,31.75 9.14,31.21 LCD.21
B1  (via drill 0.3)
  Top 0.203: IC1.11 14.02,37.99 10.32,34.29 v10.32,31.59 | LCD.22 5.76,31.71 v5.71,31.75
  Bottom 0.203: v5.71,31.75 8.1,31.75 8.41,31.43 10.16,31.43 v10.32,31.59
B2  (via drill 0.3)
  Top 0.203: IC1.12 14.31,37.49 11.11,34.29 v11.11,32.07 | LCD.23 8.75,32.21 v8.89,32.07
  Bottom 0.203: v8.89,32.07 9.05,32.23 10.95,32.23 v11.11,32.07
B3  (via drill 0.3)
  Top 0.203: IC1.13 14.61,36.99 11.91,34.29 v11.91,32.7 | LCD.24 v5.72,32.71 v5.71,32.7
  Bottom 0.203: v11.91,32.7 v5.71,32.7
B4  (via drill 0.3)
  Top 0.203: IC1.14 14.9,36.49 12.7,34.29 v12.7,33.34 | LCD.25 8.76,33.21 v8.89,33.34
  Bottom 0.203: v12.7,33.34 v8.89,33.34
B5  (via drill 0.3)
  Top 0.203: IC1.15 15.19,35.99 13.49,34.29 v13.49,33.97 | LCD.26 5.77,33.71 v5.71,33.66
  Bottom 0.203: v5.71,33.66 6.03,33.97 v13.49,33.97
B6  (via drill 0.3)
  Top 0.203: IC1.16 15.49,35.49 14.45,34.45 v14.45,34.29 | LCD.27 8.49,34.21 v8.89,34.61
  Bottom 0.203: v14.45,34.29 14.13,34.61 v8.89,34.61
B7  (via drill 0.3)
  Top 0.203: IC1.17 15.94,34.99 v15.4,34.45 | LCD.28 5.81,34.71 v5.71,34.61
  Bottom 0.203: v5.71,34.61 7.78,34.61 8.41,35.24 14.61,35.24 v15.4,34.45
CLK  (via drill 0.3)
  Top 0.203: LCD.30 8.56,35.71 v8.89,36.04 | IC1.44 28.56,25.89 v28.73,25.72
  Bottom 0.203: v8.89,36.04 14.92,36.04 16.83,34.13 16.83,29.53 20.64,25.72 v28.73,25.72
CLK_N
  Top 0.152: IC1.94 22.56,45.72 22.55,45.73 22.55,49.37 arc-90 23.97,50.79 49.37,50.79 arc-90 50.79,49.37 50.79,40.16 arc-90 49.69,39.06 44.61,39.06 44.3,38.75 HDMI.12
CLK_P
  Top 0.152: IC1.93 23.06,45.74 22.85,45.94 22.85,49.37 arc-90 23.97,50.49 49.37,50.49 arc-90 50.49,49.37 50.49,40.16 arc-90 49.69,39.36 44.61,39.36 44.22,39.75 HDMI.10
D0_N
  Top 0.152: IC1.91 24.06,45.8 24.14,45.88 24.14,48.58 arc-90 25.4,49.84 46.35,49.84 arc-90 47.46,48.74 47.46,46.35 arc90 47.94,45.87 49.21,45.87 arc-90 49.84,45.24 arc-90 49.27,44.67 47.92,44.67 arc90 47.66,44.41 47.66,44.21 arc90 47.92,43.94 49.27,43.94 arc-90 49.84,43.37 49.84,43.17 arc-90 49.27,42.6 47.93,42.6 arc90 47.67,42.34 47.67,42.14 arc90 47.93,41.87 49.11,41.87 arc-90 49.68,41.3 49.68,41.12 arc-90 49.05,40.49 44.61,40.49 44.37,40.25 HDMI.9
D0_P
  Top 0.152: IC1.90 24.56,45.76 24.44,45.88 24.44,48.58 arc-90 25.4,49.54 46.35,49.54 arc-90 47.16,48.74 47.16,46.35 arc90 47.94,45.57 49.21,45.57 arc-90 49.54,45.24 arc-90 49.27,44.98 47.93,44.98 arc90 47.36,44.41 47.36,44.21 arc90 47.93,43.64 49.27,43.64 arc-90 49.54,43.37 49.54,43.17 arc-90 49.27,42.91 47.93,42.91 arc90 47.36,42.34 47.36,42.14 arc90 47.93,41.57 49.11,41.57 arc-90 49.38,41.3 49.38,41.12 arc-90 49.05,40.79 44.61,40.79 44.15,41.25 HDMI.7
D1_N
  Top 0.152: IC1.86 26.56,45.76 26.68,45.88 26.68,47.78 arc-90 27.78,48.89 29.25,48.89 arc-90 29.82,48.32 arc90 30.08,48.05 30.14,48.05 arc90 30.41,48.32 arc-90 30.98,48.89 31.04,48.89 arc-90 31.61,48.32 arc90 31.88,48.05 31.93,48.05 arc90 32.2,48.32 arc-90 32.77,48.89 32.83,48.89 arc-90 33.4,48.32 arc90 33.67,48.05 33.72,48.05 arc90 33.99,48.32 arc-90 34.56,48.89 34.62,48.89 arc-90 35.19,48.32 arc90 35.46,48.05 35.52,48.05 arc90 35.78,48.32 arc-90 36.35,48.89 36.93,48.89 arc-90 37.5,48.32 37.5,46.77 arc90 37.77,46.5 37.88,46.5 arc90 38.15,46.77 38.15,48.32 arc-90 38.72,48.89 38.84,48.89 arc-90 39.41,48.32 39.41,46.77 arc90 39.68,46.51 39.8,46.51 arc90 40.06,46.77 40.06,48.32 arc-90 40.63,48.89 40.75,48.89 arc-90 41.32,48.32 41.32,46.77 arc90 41.59,46.5 41.71,46.5 arc90 41.97,46.77 41.97,48.32 arc-90 42.55,48.89 45.72,48.89 arc-90 46.51,48.1 46.51,48.01 arc-90 45.94,47.44 arc90 45.67,47.17 45.67,47.12 arc90 45.94,46.85 arc-90 46.51,46.28 46.51,46.23 arc-90 45.94,45.65 arc90 45.67,45.39 45.67,45.33 arc90 45.94,45.06 arc-90 46.51,44.49 46.51,44.44 arc-90 45.94,43.87 arc90 45.67,43.6 45.67,43.54 arc90 45.94,43.27 arc-90 46.51,42.7 arc-90 45.72,41.92 44.61,41.92 44.44,41.75 HDMI.6
D1_P
  Top 0.152: IC1.85 27.06,45.8 26.98,45.88 26.98,47.78 arc-90 27.78,48.58 29.25,48.58 arc-90 29.51,48.32 arc90 30.08,47.75 30.14,47.75 arc90 30.71,48.32 arc-90 30.98,48.58 31.04,48.58 arc-90 31.3,48.32 arc90 31.88,47.75 31.93,47.75 arc90 32.5,48.32 arc-90 32.77,48.58 32.83,48.58 arc-90 33.09,48.32 arc90 33.67,47.75 33.72,47.75 arc90 34.3,48.32 arc-90 34.56,48.58 34.62,48.58 arc-90 34.89,48.32 arc90 35.46,47.75 35.52,47.75 arc90 36.09,48.32 arc-90 36.35,48.58 36.93,48.58 arc-90 37.2,48.32 37.2,46.77 arc90 37.77,46.2 37.88,46.2 arc90 38.46,46.77 38.46,48.32 arc-90 38.72,48.58 38.84,48.58 arc-90 39.11,48.32 39.11,46.77 arc90 39.68,46.2 39.8,46.2 arc90 40.37,46.77 40.37,48.32 arc-90 40.63,48.58 40.75,48.58 arc-90 41.02,48.32 41.02,46.77 arc90 41.59,46.2 41.71,46.2 arc90 42.28,46.77 42.28,48.32 arc-90 42.55,48.58 45.72,48.58 arc-90 46.2,48.1 46.2,48.01 arc-90 45.94,47.75 arc90 45.36,47.17 45.36,47.12 arc90 45.94,46.55 arc-90 46.2,46.28 46.2,46.23 arc-90 45.94,45.96 arc90 45.36,45.39 45.36,45.33 arc90 45.94,44.76 arc-90 46.2,44.49 46.2,44.44 arc-90 45.94,44.17 arc90 45.36,43.6 45.36,43.54 arc90 45.94,42.97 arc-90 46.2,42.7 arc-90 45.72,42.22 44.61,42.22 44.08,42.75 HDMI.4
D2_N
  Top 0.152: 29.06,45.89 29.06,45.88 | 29.06,45.88 29.06,46.51 arc-90 29.69,47.14 35.72,47.14 arc-90 36.74,46.12 36.74,40.26 arc90 37.01,39.99 37.06,39.99 arc90 37.32,40.26 37.32,44.83 arc-90 37.9,45.4 37.94,45.4 arc-90 38.51,44.83 38.51,40.35 arc90 38.78,40.08 38.83,40.08 arc90 39.09,40.35 39.09,44.83 arc-90 39.66,45.4 39.71,45.4 arc-90 40.28,44.83 40.28,40.26 arc90 40.55,39.99 40.6,39.99 arc90 40.86,40.26 40.86,44.83 arc-90 41.43,45.4 44.29,45.4 arc-90 44.92,44.77 44.92,44.61 arc-90 44.93,44.6 44.93,44.13 arc-90 44.04,43.25 HDMI.3 | IC1.81 29.06,45.88
D2_P
  Top 0.152: IC1.80 29.56,45.75 29.36,45.94 29.36,46.51 arc-90 29.69,46.84 35.72,46.84 arc-90 36.44,46.12 36.44,40.26 arc90 37.01,39.69 37.06,39.69 arc90 37.63,40.26 37.63,44.83 arc-90 37.9,45.09 37.94,45.09 arc-90 38.21,44.83 38.21,40.26 arc90 38.78,39.69 38.83,39.69 arc90 39.4,40.26 39.4,44.83 arc-90 39.66,45.09 39.71,45.09 arc-90 39.98,44.83 39.98,40.26 arc90 40.55,39.69 40.6,39.69 arc90 41.17,40.26 41.17,44.83 arc-90 41.43,45.09 44.29,45.09 arc-90 44.62,44.77 44.62,44.14 arc-90 44.45,43.97 arc-90 44.29,44.13 arc90 44.17,44.25 HDMI.1
D_N
  Top 0.152: R11.2 38.73,24.77 36.51,24.77 arc90 34.76,23.02 34.84,22.94 IC4.3
D_P
  Top 0.152: R10.2 38.73,25.08 36.52,25.08 arc90 34.45,23.02 34.34,22.9 IC4.4
DDC_SCL
  Top 0.203: HDMI.15 40.54,37.25 39.69,38.1 37.62,38.1 36.83,37.31 | SCL.1 36.51,30.48 36.83,30.8 IC2.1 36.83,32.23 35.24,33.81 35.24,35.72 36.83,37.31 | 36.83,37.31 R5.2
DDC_SDA
  Top 0.152: IC2.3
  Top 0.203: HDMI.16 38.73,36.75 | 38.73,36.75 38.34,36.75 37.78,36.2 37.78,33.18 38.73,32.23 IC2.3 | SDA.1 IC2.3 | R4.2 38.73,36.75
DE  (via drill 0.3)
  Top 0.203: LCD.34 5.95,37.71 v5.71,37.94 | IC1.46 29.56,27.81 v29.37,27.62
  Bottom 0.203: v5.71,37.94 15.56,37.94 18.41,35.08 18.41,30.48 21.27,27.62 v29.37,27.62
G0
  Top 0.203: LCD.13 8.35,27.21 8.57,26.99 9.21,26.99 9.68,27.46 9.68,29.05 14.13,33.5 IC1.20
G1  (via drill 0.3)
  Top 0.203: IC1.21 14.41,32.99 10.48,29.05 v10.48,27.15 | LCD.14 5.79,27.71 v5.71,27.78
  Bottom 0.203: v5.71,27.78 7.62,27.78 8.26,27.15 v10.48,27.15
G2  (via drill 0.3)
  Top 0.203: IC1.22 14.71,32.49 11.27,29.05 v11.27,27.78 | LCD.15 8.46,28.21 v8.89,27.78
  Bottom 0.203: v8.89,27.78 v11.27,27.78
G3  (via drill 0.3)
  Top 0.203: IC1.23 15,31.99 12.06,29.05 v12.06,28.42 | LCD.16 5.74,28.71 v5.71,28.73
  Bottom 0.203: v5.71,28.73 6.03,28.42 v12.06,28.42
G4  (via drill 0.3)
  Top 0.203: IC1.24 15.3,31.49 13.02,29.21 v13.02,28.89 | LCD.17 8.73,29.21 v8.89,29.05
  Bottom 0.203: v8.89,29.05 12.86,29.05 v13.02,28.89
G5  (via drill 0.3)
  Top 0.203: IC1.25 15.59,30.99 13.97,29.37 v13.97,29.05 | LCD.18 5.74,29.71 v5.71,29.69
  Bottom 0.203: v5.71,29.69 13.49,29.69 13.97,29.21 v13.97,29.05
G6  (via drill 0.3)
  Top 0.203: LCD.19 8.78,30.21 v8.89,30.32 | IC1.26 19.56,28.61 19.53,28.57 v14.76,28.57
  Bottom 0.203: v8.89,30.32 13.81,30.32 14.76,29.37 v14.76,28.57
G7  (via drill 0.3)
  Top 0.203: LCD.20 5.81,30.71 v5.71,30.8 | v15.56,29.37 18.41,29.37 19.21,30.16 19.68,30.16 20.06,29.79 IC1.27
  Bottom 0.203: v5.71,30.8 5.87,30.96 13.97,30.96 v15.56,29.37
GND  (via drill 0.3)
  Top 0.152: 7.94,22.23 8.41,21.75
  Top 0.203: IC1.98 20.56,46.12 20.65,46.21 R1.1
  Top 0.406: IC3.2 8.89,14.29 9.38,13.8 RS1.1
  other vias: 25.56,36.99 24.29,36.99 26.83,36.99 28.1,36.99 29.37,36.99 29.37,38.26 28.1,38.26 26.83,38.26 25.56,38.26 24.29,38.26 23.02,38.26 21.75,38.26 21.75,36.99 23.02,36.99 21.75,39.53 21.75,40.8 23.02,40.8 24.29,40.8 25.56,40.8 20.48,40.8 20.48,39.53 20.48,38.26 20.48,36.99 30.64,36.99 30.64,38.26 29.37,39.53 30.64,39.53 26.83,39.53 28.1,39.53 25.56,39.53 24.29,39.53 23.02,39.53 21.75,42.07 23.02,42.07 24.29,42.07 25.56,42.07 20.48,42.07 26.83,40.8 28.1,40.8 29.37,40.8 30.64,40.8 26.83,42.07 28.1,42.07 29.37,42.07 30.64,42.07 26.83,33.18 28.1,33.18 29.37,33.18 30.64,33.18 21.75,34.45 21.75,35.72 23.02,35.72 24.29,35.72 25.56,35.72 20.48,35.72 20.48,34.45 29.37,34.45 30.64,34.45 26.83,34.45 28.1,34.45 25.56,34.45 24.29,34.45 23.02,34.45 26.83,35.72 28.1,35.72 29.37,35.72 30.64,35.72 21.75,31.91 21.75,33.18 23.02,33.18 24.29,33.18 25.56,33.18 20.48,33.18 20.48,31.91 29.37,31.91 30.64,31.91 26.83,31.91 28.1,31.91 25.56,31.91 24.29,31.91 23.02,31.91 19.21,30.96 16.03,30.32 3.17,13.49 2.06,11.43 2.06,18.73 10.32,12.06 5.71,22.54 20.64,7.46 44.77,36.35 28.1,46.67 25.56,46.67 23.5,46.67 35.4,46.04 33.34,46.04 44.93,38.26 41.43,39.21 21.59,48.74 21.59,50.8 46.83,38.26 48.74,38.26 50.64,38.26 39.69,39.21 37.94,39.21 35.88,39.37 35.56,41.27 35.56,43.34 50.96,50.8 44.29,24.92 45.09,26.04 45.09,13.81 45.09,12.86 31.27,20.95 37.78,17.3 41.75,26.19 41.75,23.65 35.88,23.97 34.45,24.77 37.62,25.88 37.62,24.13 35.88,25.72 43.66,23.65 43.5,26.19 38.1,21.11 50.48,17.94 50.48,6.51 50.5,29.53 35.24,12.06 2.06,13.49 17.46,16.51 13.34,16.51 41.75,18.57 41.75,21.11 25.24,21.43 14.76,18.41 6.35,45.72 1.27,41.27 1.27,22.54 15.88,42.55 13.65,6.03 13.97,50.8 14.76,23.5 35.56,31.75 24.45,16.99 44.15,29.53 39.85,26.51 20.64,3.17 1.27,5.71 1.27,31.43 6.35,4.45 31.27,14.13 30,25.4 49.69,49.53 46.83,41.43 49.69,40.01 48.1,49.53 23.5,48.74 25.56,48.74 21.59,46.67 5.71,35.72
  pour Bottom (rank 2): 0,0 52,0 52,52 0,52
  pour Top (rank 2): 0,0 52,0 52,52 0,52
GPIO
  Top 0.203: IC4.25 31.84,14.99 32.86,13.97 34.92,13.97 35.56,13.34 36.04,13.34 36.83,12.54 T5.3
HDMI_5V
  Top 0.254: HDMI.18 44.26,35.75 44.61,35.4 44.61,34.92 44.29,34.61 42.7,34.61 42.07,33.97 42.07,28.57 41.63,28.13 HPWR.1
HDMI_DECT
  Top 0.203: HDMI.19 R3.1
HSYNC  (via drill 0.3)
  Top 0.203: LCD.32 5.75,36.71 v5.71,36.67 | IC1.48 30.56,28.02 v30.96,27.62
  Bottom 0.203: v5.71,36.67 15.24,36.67 17.46,34.45 17.46,29.84 20.95,26.35 30.48,26.35 30.96,26.83 v30.96,27.62
HWB
  Top 0.203: IC4.33 35.84,15.44 35.88,15.4 37.78,15.4 38.26,14.92 R9.1
LED1
  Top 0.203: IC4.31 34.84,14.85 35.72,13.97 36.99,13.97 37.78,13.18 38.89,13.18 39.37,12.7 R20.1
LED2
  Top 0.203: IC4.32 35.34,15.14 35.88,14.61 37.31,14.61 38.26,13.65 39.85,13.65 40.8,12.7 R21.1
LED+
  Top 0.254: IC3.5 1.27,14.29 | C9.2 | LCD.2 6.15,21.71 6.03,21.59
  Top 0.406: C9.2 4.74,7.3 D6.C | C9.2 1.91,7.3 1.27,7.94 1.27,14.29 1.27,16.51 L+.1 1.27,20.32 2.54,21.59 6.03,21.59
LED-
  Top 0.254: 9.68,16.54 40MA.1 | LCD.1 7.3,21.11
  Top 0.406: 40MA.1 L-.1 7.3,17.46 7.3,21.11 | RS1.2 9.68,15.24 | 9.68,15.24 9.68,16.54 | IC3.3 9.68,15.24
LIGHT  (via drill 0.3)
  Top 0.203: IC4.40 37.28,19.55 38.1,18.73 | 38.1,18.73 C16.2 R12.2 | v37.94,18.73 38.1,18.73
  Bottom 0.203: v37.94,18.73 37.31,18.73 36.51,17.94 36.51,11.43 30.92,5.84
  Bottom 0.406: 30.92,5.84 30.92,4.79 RPI.11
LV_GPIO  (via drill 0.3)
  Top 0.203: v38.1,10.95 37.78,10.64 T5.2 37.78,8.57 37.48,8.27 R19.1
  Bottom 0.203: v38.1,10.95 36.04,8.89 36.04,5.71
  Bottom 0.406: 36.04,5.71 36.04,4.79 RPI.7
LV_RXD  (via drill 0.3)
  Top 0.203: T3.2 31.11,8.57 30.81,8.27 R17.1 30.8,8.08 v30.8,7.14 | RPI.8 | 34.77,3.49 v32.23,3.49
  Top 0.406: RPI.8 34.77,3.49
  Bottom 0.203: v30.8,7.14 29.69,6.03 29.69,3.97 30.16,3.49 v32.23,3.49
LV_SCL
  Top 0.203: T2.2 24.45,8.57 24.14,8.27 R16.1 24.13,8.08 24.13,7.62 24.77,6.99 27.3,6.99 28.26,6.03 38.1,6.03 38.56,5.57
  Top 0.406: RPI.5 38.56,5.57
LV_SDA
  Top 0.203: T1.2 27.78,8.57 27.48,8.27 R15.1 27.46,8.08 27.46,7.94 28.89,6.51 40.16,6.51 41.1,5.57
  Top 0.406: RPI.3 41.1,5.57
LV_TXD  (via drill 0.3)
  Top 0.203: T4.2 34.45,8.57 34.15,8.27 R18.1 34.13,8.08 v34.13,7.14
  Bottom 0.203: v34.13,7.14 34.77,6.51 34.77,3.65
  Bottom 0.406: RPI.10 33.48,2.37 34.77,3.65
LX
  Top 0.203: 8.73,10.88 L1.2 | 9.53,7.65 D6.A
  Top 0.406: IC3.1 8.03,12.77 8.73,12.06 8.73,10.88 | L1.2 8.82,9.44 9.53,8.73 9.53,7.65
MISO
  Top 0.152: IC4.11 30.41,22.45 28.89,23.97 25.24,23.97 24.61,23.34 24.61,18.41 23.5,17.3
  Top 0.406: 23.5,17.3 ISP.MISO
MOSI
  Top 0.152: 21.27,18.57 23.5,18.57 24.29,19.37 24.29,23.5 25.08,24.29 29.05,24.29 30.16,23.18 31.11,23.18 31.34,22.95 IC4.10
  Top 0.406: ISP.MOSI 21.27,18.57
N$4
  Top 0.254: 11.27,16.48 40MA.2
  Top 0.406: RS2.2 11.27,16.48
N$6
  Top 0.203: OCK-INV.1 17.91,46.99 R1.2 19.35,46.21 19.56,46.01 IC1.100
N$8
  Top 0.203: IC4.6 C10.2
N$11
  Top 0.406: PWR.2 43.02,18.1 42.55,17.62 F1.2
N$17
  Top 0.203: R20.2 LED1.A
N$18
  Top 0.203: R21.2 LED2.A
PDO
  Top 0.203: IC1.9 16.26,38.99 15.89,39.35 R2.1 13.64,39.35 10.95,36.67 8.57,36.67 8.11,36.21 LCD.31
PWM  (via drill 0.3)
  Top 0.203: RPI.12 30.94,2.26 | 29.7,3.49 v23.18,3.49 | v5.56,16.19 5.56,15.31 IC3.4 | IC4.29 33.84,14.63 v33.81,14.61
  Top 0.254: 5.56,15.31 5.56,15.24 4.13,15.24 | 4.13,15.24 2.7,15.24 R7A.2 | R7B.1 4.13,15.24
  Top 0.406: 30.94,2.26 29.7,3.49
  Bottom 0.203: v23.18,3.49 23.18,12.86 | v33.81,14.61 32.38,16.03 28.1,16.03 24.92,12.86 23.18,12.86 | 23.18,12.86 8.89,12.86 v5.56,16.19
R0
  Top 0.203: IC1.30 21.56,28.07 21.27,27.78 13.02,27.78 9.84,24.61 9.84,23.34 9.21,22.7 8.89,22.7 8.38,23.21 LCD.5
R1  (via drill 0.3)
  Top 0.203: IC1.31 22.06,27.93 21.43,27.3 13.34,27.3 10.48,24.45 v10.48,22.86 | LCD.6 5.77,23.71 v5.71,23.65
  Bottom 0.203: v5.71,23.65 6.51,22.86 v10.48,22.86
R2  (via drill 0.3)
  Top 0.203: IC1.32 22.56,27.8 21.59,26.83 13.65,26.83 11.43,24.61 v11.43,23.5 | LCD.7 8.34,24.21 v9.05,23.5
  Bottom 0.203: v9.05,23.5 v11.43,23.5
R3  (via drill 0.3)
  Top 0.203: IC1.33 23.06,27.66 21.75,26.35 13.97,26.35 12.38,24.77 v12.38,24.13 | LCD.8 5.77,24.71 v5.71,24.77
  Bottom 0.203: v5.71,24.77 6.35,24.13 v12.38,24.13
R4  (via drill 0.3)
  Top 0.203: IC1.34 23.56,27.53 21.91,25.88 14.45,25.88 v13.34,24.77 | LCD.9 8.45,25.21 v8.89,24.77
  Bottom 0.203: v8.89,24.77 v13.34,24.77
R5  (via drill 0.3)
  Top 0.203: IC1.35 24.06,27.39 22.07,25.4 15.08,25.4 v14.45,24.77 | LCD.10 5.73,25.71 v5.71,25.72
  Bottom 0.203: v5.71,25.72 6.03,25.4 13.81,25.4 v14.45,24.77
R6  (via drill 0.3)
  Top 0.203: IC1.36 24.56,27.26 22.23,24.92 15.72,24.92 v15.56,24.77 | LCD.11 8.72,26.21 v8.89,26.04
  Bottom 0.203: v8.89,26.04 14.29,26.04 v15.56,24.77
R7  (via drill 0.3)
  Top 0.203: LCD.12 5.84,26.71 v5.71,26.83 | IC1.37 25.06,27.12 22.38,24.45 16.51,24.45 v16.35,24.29
  Bottom 0.203: v5.71,26.83 5.87,26.67 9.68,26.67 9.84,26.51 14.92,26.51 16.35,25.08 v16.35,24.29
RST  (via drill 0.3)
  Top 0.203: IC4.13 29.43,21.05 28.42,22.07 v28.42,22.54 28.1,22.86 R8.1
  Bottom 0.203: ISP.RST 28.26,22.38 v28.42,22.54
RXD
  Top 0.203: IC4.20 29.3,17.55 28.73,16.99 28.73,13.97 30.16,12.54 T3.3
SCDT
  Top 0.203: IC1.8 16.71,39.49 16.35,39.85 16.35,40.16 15.86,40.66 R2.2
SCK
  Top 0.152: 23.5,19.84 23.97,20.32 23.97,23.65 24.92,24.61 29.21,24.61 30.16,23.65 31.27,23.65 31.84,23.09 IC4.9
  Top 0.406: ISP.SCK 23.5,19.84
SCL  (via drill 0.3)
  Top 0.203: T2.3 23.5,12.54 24.29,13.34 26.51,13.34 27.78,14.61 27.78,17.3 29.03,18.55 IC4.18 30.77,18.55 32.38,20.16 v32.38,20.95 | SCL.2 33.85,28.13 v33.02,27.3
  Bottom 0.203: v32.38,20.95 32.38,26.67 v33.02,27.3
SDA  (via drill 0.3)
  Top 0.203: T1.3 26.83,12.54 28.26,13.97 28.26,17.14 29.16,18.05 IC4.19 31.07,18.05 33.5,20.48 v33.5,20.95 | SDA.2 38.73,27.46 38.1,26.83 v34.92,26.83
  Bottom 0.203: v33.5,20.95 33.5,25.4 v34.92,26.83
SHLD1
  Top 0.152: DATA.SHLD2 49.25,24.96 49.21,24.92 | DATA.SHLD1 49.23,23.04 49.21,23.02
  Top 0.406: R13.2 48.42,18.89 49.21,19.68 49.21,23.02 49.21,24.92 49.21,26.67
SHLD2
  Top 0.203: POWER.SHLD2 49.32,12.96 49.21,12.86 | POWER.SHLD1 49.3,11.04 49.21,10.95
  Top 0.406: R14.2 48.42,17.14 49.21,16.35 49.21,12.86 49.21,10.95 49.21,9.37
SHLD3
  Top 0.406: HDMI.SHLD2 48.9,30.17 48.26,29.53 R6.2
  Bottom 0.406: 47.78,32.54 44,32.54 HDMI.SHLD1 | 47.78,32.54 48.9,32.54 HDMI.SHLD2 | 47.78,32.54 47.78,46.99 | 47.78,46.99 48.9,46.99 HDMI.SHLD3 | 47.78,46.99 HDMI.SHLD4
SW1  (via drill 0.3)
  Top 0.203: SW1.1 SW1.4 22.73,6.19 26.99,6.19 | IC4.22 29.89,16.55 29.84,16.51 29.84,14.61 v30,14.45 | RPI.13
  Top 0.406: RPI.13 26.99,6.19
  Bottom 0.203: v30,14.45 30,8.41 28.42,6.83 28.42,5.87
  Bottom 0.406: 28.42,5.87 28.42,4.79 RPI.13
TXD
  Top 0.203: IC4.21 29.43,17.05 29.21,16.83 29.21,14.29 30.48,13.02 33.02,13.02 33.5,12.54 T4.3
USBD_N
  Top 0.152: R11.1 40.48,24.29 40.96,24.77 42.07,24.77 D1.2 | DATA.D- 45.88,23.35 45.74,23.5 44.77,23.5 arc-90 44.45,23.81 44.45,23.98 arc90 44.13,24.3 42.54,24.3 D1.2 | D1.2
USBD_P
  Top 0.152: R10.1 40.48,25.56 40.96,25.08 42.07,25.08 D1.1 | DATA.D+ 45.37,24 arc-90 44.92,24.45 44.92,24.92 arc90 44.29,25.55 42.55,25.55 D1.1 | D1.1
VBUS
  Top 0.406: DATA.VBUS 45.24,22.7 44.93,22.38
  Top 0.61: 45.09,22.54 44.93,22.38 43.97,21.43 PWR.3
VBUS_PWR
  Top 0.406: POWER.VBUS 45.18,10.7 44.93,10.95
  Top 0.61: 45.02,10.86 44.93,10.95 43.97,11.91 PWR.1
VCCIO
  Top 0.203: 25.88,10.79 29.21,10.79 | 29.21,10.79 32.54,10.79 | 32.54,10.79 35.56,10.79 35.88,10.48 T5.1 35.88,8.57 36.18,8.27 R19.2 36.18,7.48 36.67,6.99 42.23,6.99 43.64,5.57 | 32.54,10.79 32.55,10.79 T4.1 32.54,8.57 32.85,8.27 R18.2 | 25.88,10.79 22.54,10.79 | 25.88,10.79 T1.1 25.88,8.57 26.18,8.27 R15.2 | 29.21,10.79 T3.1 29.21,8.57 29.51,8.27 R17.2 | VCCIO.2 22.86,13.81 22.54,13.49 22.54,10.79 | R16.2 22.84,8.27 22.54,8.57 T2.1 22.54,10.79
  Top 0.406: RPI.1 43.64,5.57
VSYNC  (via drill 0.3)
  Top 0.203: LCD.33 8.79,37.21 v8.89,37.31 | IC1.47 30.06,27.25 v30.16,27.15
  Bottom 0.203: v8.89,37.31 15.4,37.31 17.94,34.77 17.94,30.16 21.11,26.99 30,26.99 v30.16,27.15
X+  (via drill 0.3)
  Top 0.203: IC4.39 36.04,19.05 35.56,19.53 v35.4,19.53 | X+.1 10.69,49 13.97,45.72 13.97,40.8 12.06,38.89 v8.89,38.89 8.57,38.89 8.26,39.21 LCD.37
  Bottom 0.203: v8.89,38.89 5.08,38.89 4.13,37.94 4.13,22.07 11.11,15.08 23.81,15.08 27.3,18.57 33.97,18.57 34.92,19.53 v35.4,19.53
X-  (via drill 0.3)
  Top 0.203: LCD.39 8.85,40.21 v8.89,40.16 11.75,40.16 12.7,41.12 12.7,45.09 10.79,47 X-.1 | IC4.37 35.51,18.05 v35.4,17.94
  Bottom 0.203: v8.89,40.16 8.41,40.64 4.92,40.64 2.86,38.58 2.86,21.75 10.48,14.13 24.13,14.13 27.62,17.62 34.61,17.62 34.92,17.94 v35.4,17.94
XTAL1
  Top 0.203: IC4.17 28.57,19.05 27.22,17.69 Q1.2
XTAL2
  Top 0.203: IC4.16 28.07,19.55 27.53,20.09 Q1.1
Y+  (via drill 0.3)
  Top 0.203: v3.49,40.16 4.04,40.71 LCD.40 8.32,40.71 8.41,40.8 11.59,40.8 12.06,41.27 12.06,44.77 10.83,46 Y+.1 | IC4.36 35.97,17.55 35.56,17.14 v35.08,17.14
  Bottom 0.203: v3.49,40.16 2.22,38.89 2.22,21.59 10.16,13.65 24.29,13.65 27.78,17.14 v35.08,17.14
Y-  (via drill 0.3)
  Top 0.203: IC4.38 35.58,18.55 35.4,18.73 v35.08,18.73 | Y-.1 10.74,48 13.34,45.4 13.34,40.96 11.91,39.53 8.57,39.53 8.39,39.71 LCD.38 5.86,39.71 v5.71,39.85
  Bottom 0.203: v5.71,39.85 5.08,39.85 3.49,38.26 3.49,21.91 10.79,14.61 23.97,14.61 27.46,18.1 34.29,18.1 34.92,18.73 v35.08,18.73

### Text on the board
Top: TOP
Bottom: www.watterott.com | BOT
tPlace: HDMI-Display | Rev 1.0 | github.com/watterott/HDMI-Display | o | Data | o | 1 | 2 | Power
Reference: Silkscreen: 21 tPlace